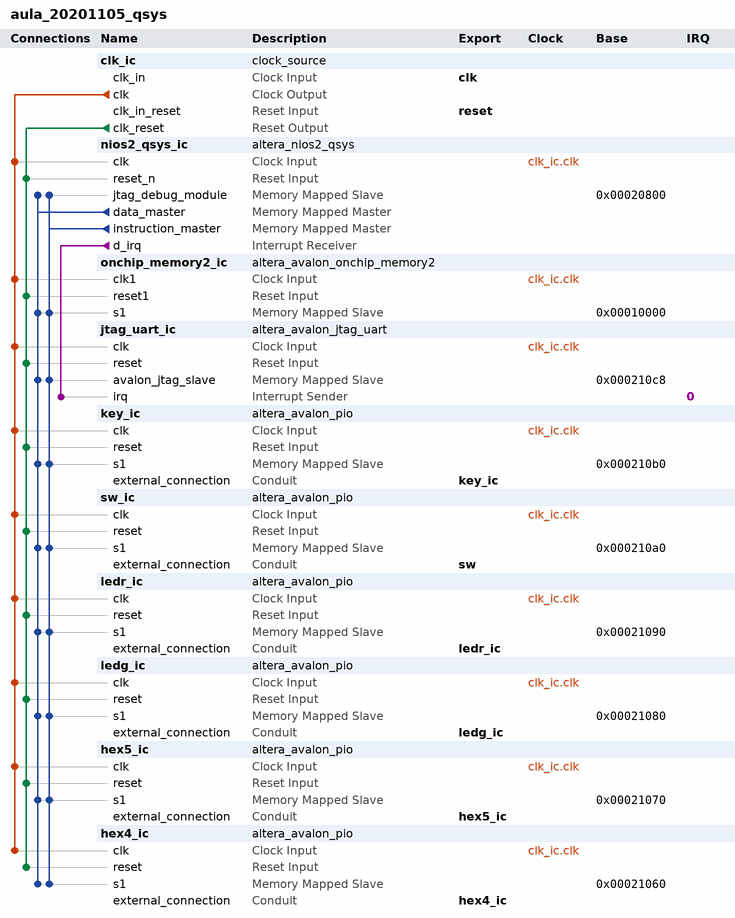
[diagram p0: system contents]
# Platform Designer (Qsys) system aula_20201105_qsys, Cyclone II EP2C35F672C6
# Parameters at their usual value, and those the tool derives, are not listed.
package require -exact qsys 13.0.1.99.2
create_system aula_20201105_qsys
set_project_property DEVICE_FAMILY {Cyclone II}
set_project_property DEVICE EP2C35F672C6

add_instance clk_ic clock_source 13.0
set_instance_parameter_value clk_ic clockFrequency 50000000

add_instance nios2_qsys_ic altera_nios2_qsys 13.0
set_instance_parameter_value nios2_qsys_ic resetSlave onchip_memory2_ic.s1
set_instance_parameter_value nios2_qsys_ic mmu_TLBMissExcSlave None
set_instance_parameter_value nios2_qsys_ic exceptionSlave onchip_memory2_ic.s1
set_instance_parameter_value nios2_qsys_ic breakSlave nios2_qsys_ic.jtag_debug_module
set_instance_parameter_value nios2_qsys_ic impl Tiny
set_instance_parameter_value nios2_qsys_ic icache_size 4096

add_instance onchip_memory2_ic altera_avalon_onchip_memory2 13.0.1.99.2
set_instance_parameter_value onchip_memory2_ic dataWidth 32
set_instance_parameter_value onchip_memory2_ic dualPort false
set_instance_parameter_value onchip_memory2_ic initMemContent true
set_instance_parameter_value onchip_memory2_ic initializationFileName onchip_mem.hex
set_instance_parameter_value onchip_memory2_ic memorySize 40960

add_instance jtag_uart_ic altera_avalon_jtag_uart 13.0.1.99.2
set_instance_parameter_value jtag_uart_ic simInteractiveOptions NO_INTERACTIVE_WINDOWS

add_instance key_ic altera_avalon_pio 13.0.1.99.2
set_instance_parameter_value key_ic direction Input
set_instance_parameter_value key_ic width 4

add_instance sw_ic altera_avalon_pio 13.0.1.99.2
set_instance_parameter_value sw_ic direction Input
set_instance_parameter_value sw_ic width 8

add_instance ledr_ic altera_avalon_pio 13.0.1.99.2
set_instance_parameter_value ledr_ic direction Output
set_instance_parameter_value ledr_ic width 8

add_instance ledg_ic altera_avalon_pio 13.0.1.99.2
set_instance_parameter_value ledg_ic direction Output
set_instance_parameter_value ledg_ic width 8

add_instance hex5_ic altera_avalon_pio 13.0.1.99.2
set_instance_parameter_value hex5_ic direction Output
set_instance_parameter_value hex5_ic width 7

add_instance hex4_ic altera_avalon_pio 13.0.1.99.2
set_instance_parameter_value hex4_ic direction Output
set_instance_parameter_value hex4_ic width 7

# connections
add_connection clk_ic.clk hex4_ic.clk clock
add_connection clk_ic.clk hex5_ic.clk clock
add_connection clk_ic.clk jtag_uart_ic.clk clock
add_connection clk_ic.clk key_ic.clk clock
add_connection clk_ic.clk ledg_ic.clk clock
add_connection clk_ic.clk ledr_ic.clk clock
add_connection clk_ic.clk nios2_qsys_ic.clk clock
add_connection clk_ic.clk onchip_memory2_ic.clk1 clock
add_connection clk_ic.clk sw_ic.clk clock
add_connection clk_ic.clk_reset hex4_ic.reset reset
add_connection clk_ic.clk_reset hex5_ic.reset reset
add_connection clk_ic.clk_reset jtag_uart_ic.reset reset
add_connection clk_ic.clk_reset key_ic.reset reset
add_connection clk_ic.clk_reset ledg_ic.reset reset
add_connection clk_ic.clk_reset ledr_ic.reset reset
add_connection clk_ic.clk_reset nios2_qsys_ic.reset_n reset
add_connection clk_ic.clk_reset onchip_memory2_ic.reset1 reset
add_connection clk_ic.clk_reset sw_ic.reset reset
add_connection nios2_qsys_ic.data_master hex4_ic.s1 avalon
set_connection_parameter_value nios2_qsys_ic.data_master/hex4_ic.s1 baseAddress 0x00021060
add_connection nios2_qsys_ic.data_master hex5_ic.s1 avalon
set_connection_parameter_value nios2_qsys_ic.data_master/hex5_ic.s1 baseAddress 0x00021070
add_connection nios2_qsys_ic.data_master jtag_uart_ic.avalon_jtag_slave avalon
set_connection_parameter_value nios2_qsys_ic.data_master/jtag_uart_ic.avalon_jtag_slave baseAddress 0x000210c8
add_connection nios2_qsys_ic.data_master key_ic.s1 avalon
set_connection_parameter_value nios2_qsys_ic.data_master/key_ic.s1 baseAddress 0x000210b0
add_connection nios2_qsys_ic.data_master ledg_ic.s1 avalon
set_connection_parameter_value nios2_qsys_ic.data_master/ledg_ic.s1 baseAddress 0x00021080
add_connection nios2_qsys_ic.data_master ledr_ic.s1 avalon
set_connection_parameter_value nios2_qsys_ic.data_master/ledr_ic.s1 baseAddress 0x00021090
add_connection nios2_qsys_ic.data_master nios2_qsys_ic.jtag_debug_module avalon
set_connection_parameter_value nios2_qsys_ic.data_master/nios2_qsys_ic.jtag_debug_module baseAddress 0x00020800
add_connection nios2_qsys_ic.data_master onchip_memory2_ic.s1 avalon
set_connection_parameter_value nios2_qsys_ic.data_master/onchip_memory2_ic.s1 baseAddress 0x00010000
add_connection nios2_qsys_ic.data_master sw_ic.s1 avalon
set_connection_parameter_value nios2_qsys_ic.data_master/sw_ic.s1 baseAddress 0x000210a0
add_connection nios2_qsys_ic.instruction_master hex4_ic.s1 avalon
set_connection_parameter_value nios2_qsys_ic.instruction_master/hex4_ic.s1 baseAddress 0x00021060
add_connection nios2_qsys_ic.instruction_master hex5_ic.s1 avalon
set_connection_parameter_value nios2_qsys_ic.instruction_master/hex5_ic.s1 baseAddress 0x00021070
add_connection nios2_qsys_ic.instruction_master jtag_uart_ic.avalon_jtag_slave avalon
set_connection_parameter_value nios2_qsys_ic.instruction_master/jtag_uart_ic.avalon_jtag_slave baseAddress 0x000210c8
add_connection nios2_qsys_ic.instruction_master key_ic.s1 avalon
set_connection_parameter_value nios2_qsys_ic.instruction_master/key_ic.s1 baseAddress 0x000210b0
add_connection nios2_qsys_ic.instruction_master ledg_ic.s1 avalon
set_connection_parameter_value nios2_qsys_ic.instruction_master/ledg_ic.s1 baseAddress 0x00021080
add_connection nios2_qsys_ic.instruction_master ledr_ic.s1 avalon
set_connection_parameter_value nios2_qsys_ic.instruction_master/ledr_ic.s1 baseAddress 0x00021090
add_connection nios2_qsys_ic.instruction_master nios2_qsys_ic.jtag_debug_module avalon
set_connection_parameter_value nios2_qsys_ic.instruction_master/nios2_qsys_ic.jtag_debug_module baseAddress 0x00020800
add_connection nios2_qsys_ic.instruction_master onchip_memory2_ic.s1 avalon
set_connection_parameter_value nios2_qsys_ic.instruction_master/onchip_memory2_ic.s1 baseAddress 0x00010000
add_connection nios2_qsys_ic.instruction_master sw_ic.s1 avalon
set_connection_parameter_value nios2_qsys_ic.instruction_master/sw_ic.s1 baseAddress 0x000210a0
add_connection nios2_qsys_ic.d_irq jtag_uart_ic.irq interrupt
set_connection_parameter_value nios2_qsys_ic.d_irq/jtag_uart_ic.irq irqNumber 0

# exported interfaces
add_interface clk clock sink
set_interface_property clk EXPORT_OF clk_ic.clk_in
add_interface reset reset sink
set_interface_property reset EXPORT_OF clk_ic.clk_in_reset
add_interface key_ic conduit end
set_interface_property key_ic EXPORT_OF key_ic.external_connection
add_interface sw conduit end
set_interface_property sw EXPORT_OF sw_ic.external_connection
add_interface ledr_ic conduit end
set_interface_property ledr_ic EXPORT_OF ledr_ic.external_connection
add_interface ledg_ic conduit end
set_interface_property ledg_ic EXPORT_OF ledg_ic.external_connection
add_interface hex5_ic conduit end
set_interface_property hex5_ic EXPORT_OF hex5_ic.external_connection
add_interface hex4_ic conduit end
set_interface_property hex4_ic EXPORT_OF hex4_ic.external_connection

set_interconnect_requirement {$system} qsys_mm.clockCrossingAdapter HANDSHAKE
set_interconnect_requirement {$system} qsys_mm.maxAdditionalLatency 1

save_system aula_20201105_qsys.qsys
